# Altium schematic sheet BoostConverter.SchDoc
size A
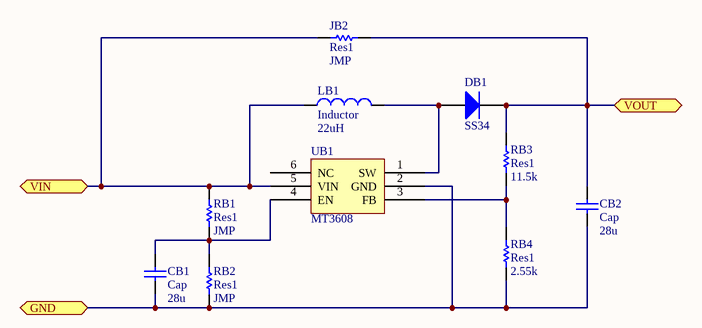
[diagram p0: BoostConverter.SchDoc]

## Parts
CB1  Cap  value 28u  [CAP0603R]
CB2  Cap  value 28u  [CAP0603R]
DB1  SS34  [DO-214AC]
JB2  Res1  value JMP  [RES0603R]
LB1  Inductor  value 22uH  [INDUCTOR CD54]
RB1  Res1  value JMP  [RES0603R]
RB2  Res1  value JMP  [RES0603R]
RB3  Res1  value 11.5k  [RES0603R]
RB4  Res1  value 2.55k  [RES0603R]
UB1  MT3608  [SOT23-6]

## Ports
GND (bidir), VIN (bidir), VOUT (bidir)

## Nets
GND: CB1.1 CB2.1 RB2.2 RB4.2 UB1.2(GND) ; port GND
VIN: JB2.1 LB1.1 RB1.1 UB1.5(VIN) ; port VIN
VOUT: CB2.2 DB1.2(K) JB2.2 RB3.1 ; port VOUT
NetCB1_2: CB1.2 RB1.2 RB2.1 UB1.4(EN)
NetDB1_1: DB1.1(A) LB1.2 UB1.1(SW)
NetRB3_2: RB3.2 RB4.1 UB1.3(FB)

Not connected (* = marked no-connect by the designer): UB1 6(NC)

## Library data of the parts
CB1 CB2 = Cap: Capacitor; Published: 8-Jun-2000; LatestRevisionDate: 17-Jul-2002; LatestRevisionNote: Re-released for DXP Platform.; PackageReference: RAD-0.3; Publisher: Altium Limited; PackageDescription: Radial Cap, Thru-Hole; 2 Leads; 0.3 in Pin Spacing
DB1 = Diode: Default Diode; Published: 8-Jun-2000; LatestRevisionDate: 17-Jul-2002; LatestRevisionNote: Re-released for DXP Platform.; PackageVersion: Sep-1996; PackageReference: SMC; Publisher: Altium Limited; PackageDescription: DO-214-AB/SMC; 2 C-Bend Leads; Body 7.9 x 5.9 mm, inc. leads (LxW); Code_JEDEC: DO-214-AB
JB2 RB1-RB4 = Res1: Resistor; Published: 8-Jun-2000; LatestRevisionDate: 17-Jul-2002; LatestRevisionNote: Re-released for DXP Platform.; PackageReference: AXIAL-0.3; Publisher: Altium Limited; PackageDescription: Axial Device, Thru-Hole; 2 Leads; 0.3 in Pin Spacing
LB1 = Inductor: Code_IEC: 1005; Published: 8-Jun-2000; LatestRevisionDate: 29-May-2009; LatestRevisionNote: IPC-7351 Footprint Added.; PackageReference: 0402-A; Publisher: Altium Limited; PackageDescription: Chip Inductor; Code_JEITA: 0402
UB1 = MT3608: Boost converter